# Altium schematic sheet STM32_min.SchDoc
size A; SheetNumber: 2; SheetTotal: 5
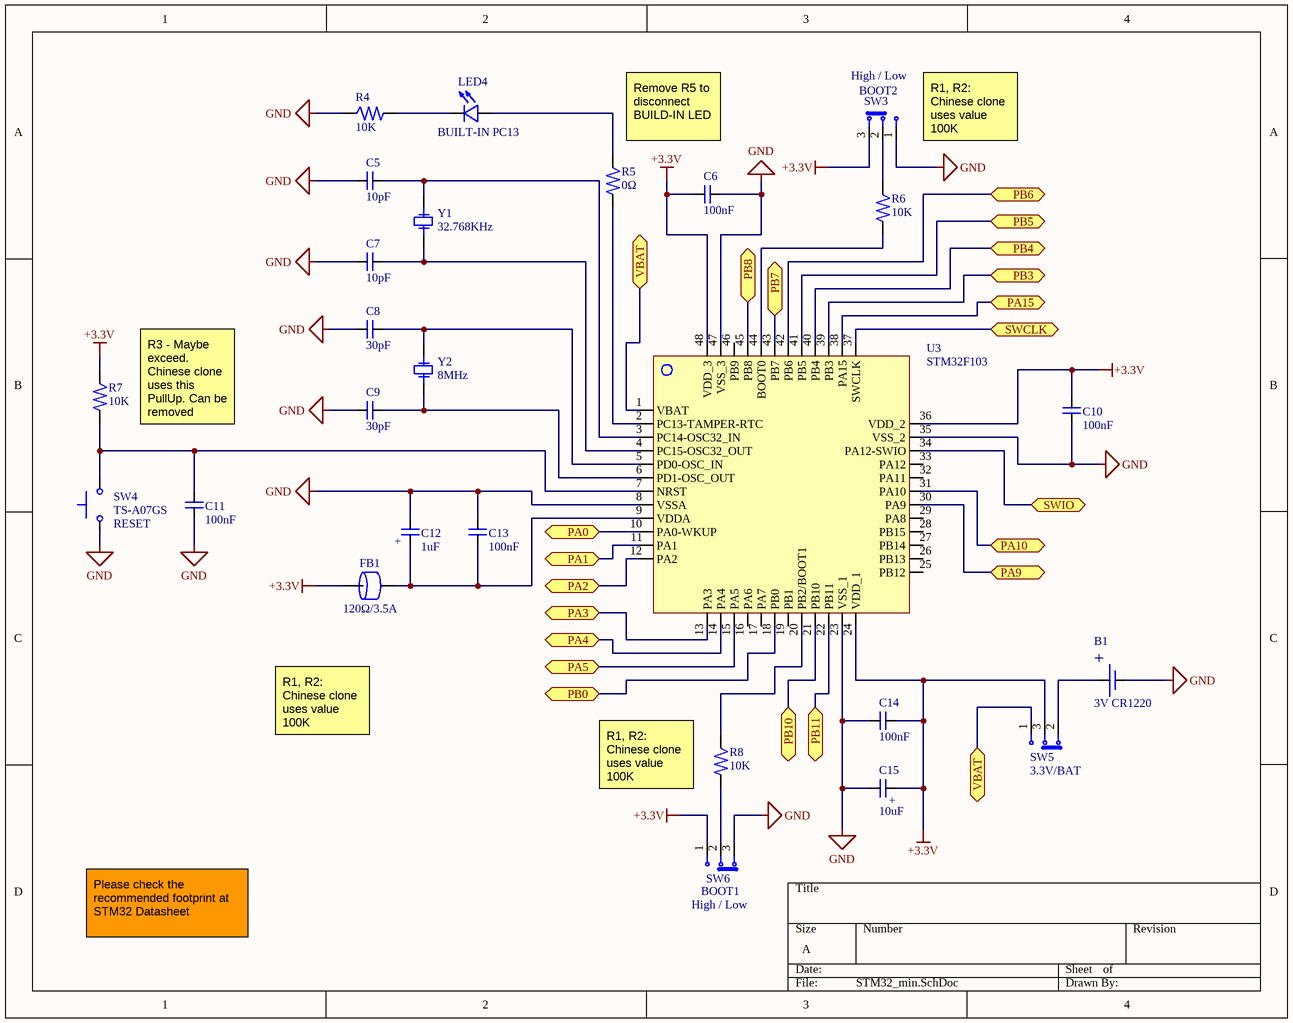
[diagram p0: STM32_min.SchDoc]

## Parts
B1  3V CR1220  [THT_BH-25T-GLD]
C5  10pF  [SMT_CAP_CER_MODEL_0805(2012)_SAMSUNG]
C6  100nF  [SMT_CAP_MODEL_1206(3216)_SAMSUNG]
C7  10pF  [SMT_CAP_CER_MODEL_0805(2012)_SAMSUNG]
C8  30pF  [SMT_CAP_MODEL_1206(3216)_SAMSUNG]
C9  30pF  [SMT_CAP_MODEL_1206(3216)_SAMSUNG]
C10  100nF  [SMT_CAP_MODEL_1206(3216)_SAMSUNG]
C11  100nF  [SMT_CAP_MODEL_1206(3216)_SAMSUNG]
C12  1uF  [SMT_CAP_TANT_MODEL_1206(3216)_KYOCERA]
C13  100nF  [SMT_CAP_MODEL_1206(3216)_SAMSUNG]
C14  100nF  [SMT_CAP_MODEL_1206(3216)_SAMSUNG]
C15  10uF  [SMT_CAP_TANT_MODEL_1210(3528)_KYOCERA]
FB1  120Ω/3.5A  [SMT_FERR_BEAD_MODEL_1206(3216)_MURATA]
LED4  BUILT-IN PC13  [DIOM2012X18N]
R4  10K  [SMT_RES_MODEL_1206(3216)_ROHM]
R5  0Ω  [SMT_RES_MODEL_1206(3216)_ROHM]
R6  10K  [SMT_RES_MODEL_1206(3216)_ROHM]
R7  10K  [SMT_RES_MODEL_1206(3216)_ROHM]
R8  10K  [SMT_RES_MODEL_1206(3216)_ROHM]
SW3  BOOT2  [SMT_SWW_SS-B90AP_DAWNING]
SW4  TS-A07GS  [SMT_TSW-A07GS]
SW5  3.3V/BAT  [THT_SSW_ESP1010]
SW6  BOOT1  [SMT_SWW_SS-B90AP_DAWNING]
U3  STM32F103  [SMT_IC_STM32F103]
Y1  32.768KHz  [SMT_XTAL_FC-135_EPSON]
Y2  8MHz  [SMT_XTAL_ATS08ASM-1E]

## Ports
PA0 (bidir), PA1 (bidir), PA2 (bidir), PA3 (bidir), PA4 (bidir), PA5 (bidir), PA9 (bidir), PA10 (bidir), PA15 (bidir), PB0 (bidir), PB3 (bidir), PB4 (bidir), PB5 (bidir), PB6 (bidir), PB7 (bidir), PB8 (bidir), PB10 (bidir), PB11 (bidir), SWCLK (bidir), SWIO (bidir), VBAT (bidir)

## Nets
+3.3V: C6.1 C10.1 C14.1 C15.1 FB1.1 R7.2 SW3.3 SW5.3 SW6.1 U3.24(VDD_1) U3.36(VDD_2) U3.48(VDD_3)
GND: B1.2(V-) C5.1 C6.2 C7.1 C8.1 C9.1 C10.2 C11.1 C12.2 C13.2 C14.2 C15.2 R4.2 SW3.1 SW4.1 SW6.3 U3.8(VSSA) U3.23(VSS_1) U3.35(VSS_2) U3.47(VSS_3)
PA0: U3.10(PA0-WKUP) ; port PA0
PA1: U3.11(PA1) ; port PA1
PA2: U3.12(PA2) ; port PA2
PA3: U3.13(PA3) ; port PA3
PA4: U3.14(PA4) ; port PA4
PA5: U3.15(PA5) ; port PA5
PA9: U3.30(PA9) ; port PA9
PA10: U3.31(PA10) ; port PA10
PA15: U3.38(PA15) ; port PA15
PB0: U3.18(PB0) ; port PB0
PB3: U3.39(PB3) ; port PB3
PB4: U3.40(PB4) ; port PB4
PB5: U3.41(PB5) ; port PB5
PB6: U3.42(PB6) ; port PB6
PB7: U3.43(PB7) ; port PB7
PB8: U3.45(PB8) ; port PB8
PB10: U3.21(PB10) ; port PB10
PB11: U3.22(PB11) ; port PB11
SWCLK: U3.37(SWCLK) ; port SWCLK
SWIO: U3.34(PA12-SWIO) ; port SWIO
VBAT: SW5.1 U3.1(VBAT) ; port VBAT
NetB1_1: B1.1(V+) SW5.2
NetC5_2: C5.2 U3.3(PC14-OSC32_IN) Y1.2
NetC7_2: C7.2 U3.4(PC15-OSC32_OUT) Y1.1
NetC8_2: C8.2 U3.5(PD0-OSC_IN) Y2.2
NetC9_2: C9.2 U3.6(PD1-OSC_OUT) Y2.1
NetC11_2: C11.2 R7.1 SW4.2 U3.7(NRST)
NetC12_1: C12.1 C13.1 FB1.2 U3.9(VDDA)
NetLED4_1: LED4.1 R5.2
NetLED4_2: LED4.2 R4.1
NetR5_1: R5.1 U3.2(PC13-TAMPER-RTC)
NetR6_1: R6.1 U3.44(BOOT0)
NetR6_2: R6.2 SW3.2
NetR8_1: R8.1 SW6.2
NetR8_2: R8.2 U3.20(PB2/BOOT1)

Not connected (* = marked no-connect by the designer): U3 16(PA6) 17(PA7) 19(PB1) 25(PB12) 26(PB13) 27(PB14) 28(PB15) 29(PA8) 32(PA11) 33(PA12) 46(PB9)

## Notes on the sheet
- (near SW3) High / Low
- (near R5) Remove R5 to disconnect BUILD-IN LED
- (near SW3) R1, R2: Chinese clone uses value 100K
- (near R7) R3 - Maybe exceed. Chinese clone uses this PullUp. Can be removed
- (near SW4) RESET
- R1, R2: Chinese clone uses value 100K
- (near R8) R1, R2: Chinese clone uses value 100K
- (near SW6) High / Low
- Please check the recommended footprint at STM32 Datasheet
- (in symbol SMT_CAP_TANT_MODEL_1206(3216)_KYOCERA) +
- (in symbol SMT_CAP_TANT_MODEL_1210(3528)_KYOCERA) +
- (in symbol THT_BH-25T-GLD) +

## Library data of the parts
B1 = THT_BH-25T-GLD: Battery Holder for CR-2032 Type Battery BH-25T-GLD
C5 C7 = SMT_CAP_CER_MODEL_0805(2012)_SAMSUNG: SMT SAMSUNG Ceramic Capacitor MODEL *V *pF 0805(2012) CL21C100DBANNNC(etc.)
C6 C8-C11 C13 C14 = SMT_CAP_MODEL_1206(3216)_SAMSUNG: SMT Samsung Ceramic Capacitor MODEL *V *nF 1206(3216)  CL31B104KBCNNNC(etc.)
C12 = SMT_CAP_TANT_MODEL_1206(3216)_KYOCERA: SMT KYOCERA Tantalum Capacitor MODEL *V *uF 1206(3216) EAN_3216-18 TAJA105M016RNJ(etc.)
C15 = SMT_CAP_TANT_MODEL_1210(3528)_KYOCERA: SMT KYOCERA Tantalum Capacitor MODEL *V *uF 1210(3528)  TAJB106K016RNJ(etc.)
FB1 = SMT_FERR_BEAD_MODEL_1206(3216)_MURATA: SMT MURATA Ferrite Bead MODEL 1206(3216) BLM31PG121SN1L *Ω/*mA
LED4 = SMT_LED_0805(2012): Led Diode 0805(2012) Cathode Mark, 20mA
R4-R8 = SMT_RES_MODEL_1206(3216)_ROHM: SMT ROHM Resistor MODEL 1206(3216) 1/4W MCR18ERTJ000
SW3 SW6 = SMT_SWW_SS-B90AP_DAWNING: Slide Switch SMD 12V 50mA 2-POS SS-B90AP-W-SP2-S085
SW4 = SMT_TSW-A07GS: Tactile Switch TS-A07GS 50mA 12V
SW5 = THT_SSW_ESP1010: Slide Switch ESP1010 12V 0.5A
U3 = SMT_IC_STM32F103: MCU STM32F103x8 LQFP48 pinout
Y1 = SMT_XTAL_FC-135_EPSON: SMD Quartz Crystal EPSON FC-135 12.5pF 32.768KHz ±20.0ppm
Y2 = SMT_XTAL_ATS08ASM-1E: SMD Quartz Crystal ATS08ASM-1E 20pF 8MHz